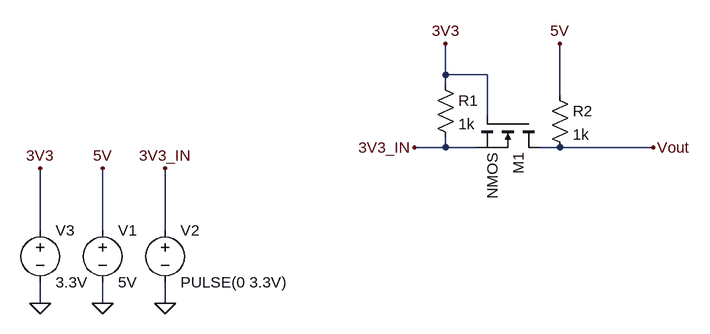
[diagram p0: schematic logic_level_shifter.asc]
logic_level_shifter.asc, the LTspice schematic file:
Version 4
SHEET 1 1116 1080
WIRE 496 32 496 -16
WIRE 560 32 496 32
WIRE 496 48 496 32
WIRE 672 64 672 -16
WIRE 560 96 560 32
WIRE 496 144 496 128
WIRE 496 144 448 144
WIRE 544 144 496 144
WIRE 672 144 640 144
WIRE 816 144 672 144
WIRE -128 272 -128 176
WIRE -32 272 -32 176
WIRE 64 272 64 176
WIRE -128 384 -128 352
WIRE -32 384 -32 352
WIRE 64 384 64 352
FLAG -32 176 5V
FLAG 64 176 3V3_IN
FLAG -32 384 0
FLAG 64 384 0
FLAG 448 144 3V3_IN
FLAG 672 -16 5V
FLAG -128 384 0
FLAG -128 176 3V3
FLAG 496 -16 3V3
FLAG 816 144 Vout
SYMBOL voltage -32 256 R0
SYMATTR InstName V1
SYMATTR Value 5V
SYMBOL voltage 64 256 R0
SYMATTR InstName V2
SYMATTR Value PULSE(0 3.3V)
SYMBOL nmos 640 96 R90
SYMATTR InstName M1
SYMBOL Res 480 32 R0
SYMATTR InstName R1
SYMATTR Value 1k
SYMBOL Res 656 48 R0
SYMATTR InstName R2
SYMATTR Value 1k
SYMBOL voltage -128 256 R0
SYMATTR InstName V3
SYMATTR Value 3.3V

The netlist it stands for:
* logic_level_shifter.asc
V1 5V 0 5V
V2 3V3_IN 0 PULSE(0 3.3V)
M1 Vout 3V3 3V3_IN 3V3_IN NMOS
R1 3V3 3V3_IN 1k
R2 5V Vout 1k
V3 3V3 0 3.3V
.model NMOS NMOS
.model PMOS PMOS
.lib standard.mos
.backanno
.end